# EAGLE schematic Downconverter (EAGLE 9.4.0)
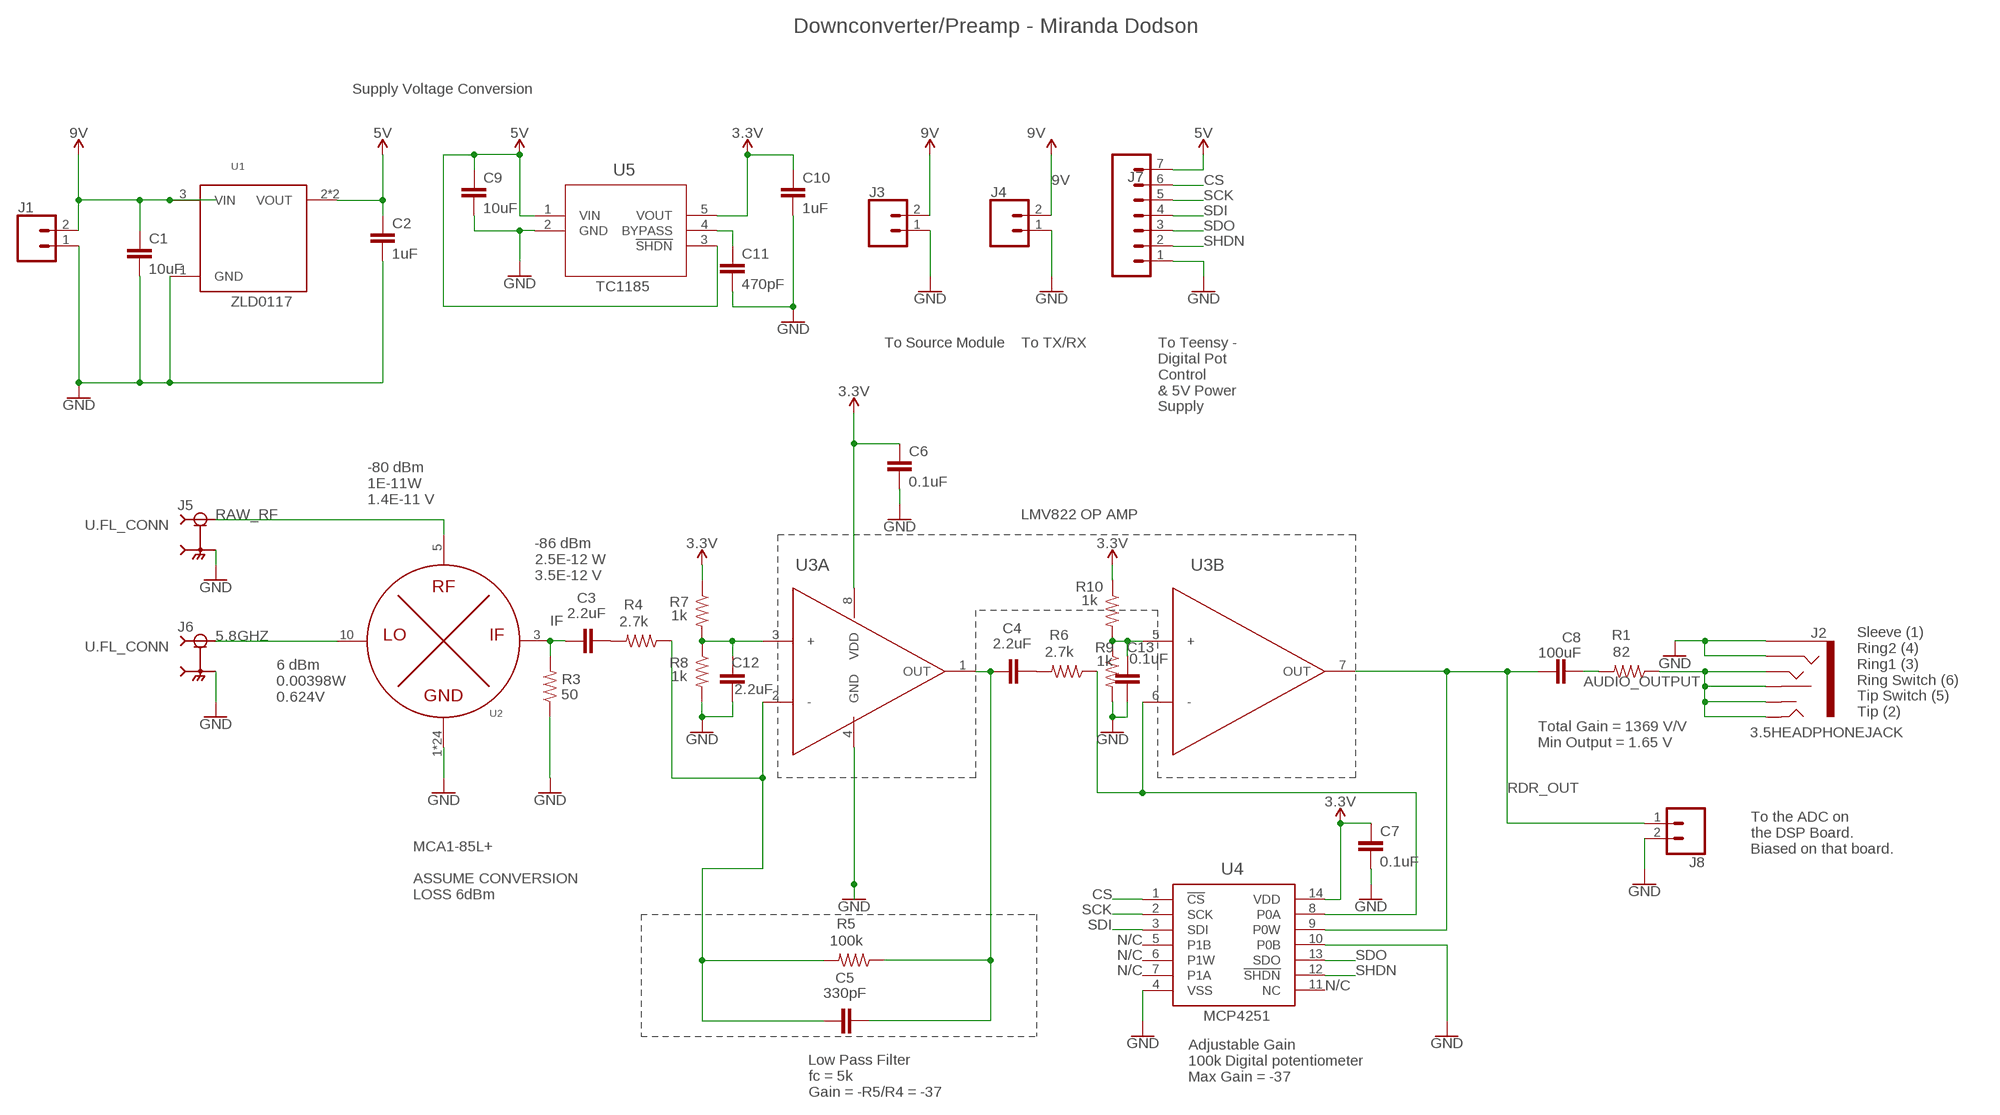
[diagram p0: schematic, sheet 1]

## Parts
C1  10uF  C0603  [R0603]
C2  1uF  C0603  [R0603]
C3  2.2uF  C0603  [R0603]
C4  2.2uF  C0603  [R0603]
C5  330pF  C0603  [R0603]
C6  0.1uF  C0603  [R0603]
C7  0.1uF  C0603  [R0603]
C8  100uF  EDK107M6R3A9GAA  [EXV-9G]
C9  10uF  C0603  [R0603]
C10  1uF  C0603  [R0603]
C11  470pF  C0603  [R0603]
C12  2.2uF  C0603  [R0603]
C13  0.1uF  C0603  [R0603]
J1  CONN_02  [1X02]
J2  3.5HEADPHONEJACK  [CONN6_SJ-43516-SMT]
J3  CONN_02  [1X02]
J4  CONN_02  [1X02]
J5  U.FL_CONN  [U.FL]
J6  U.FL_CONN  [U.FL]
J7  CONN_07  [1X07]
J8  CONN_02  [1X02]
R1  82  R0603  [R0603]
R3  50  R0603  [R0603]
R4  2.7k  R0603  [R0603]
R5  100k  R0603  [R0603]
R6  2.7k  R0603  [R0603]
R7  1k  R0603  [R0603]
R8  1k  R0603  [R0603]
R9  1k  R0603  [R0603]
R10  1k  R0603  [R0603]
U1  5V_REG  [5V_REG]
U2  MIXER  [MIXER]
U3  DUAL_OP_AMP_LMV822  [M08A]
U4  DIGITAL_POTDIGITAL_POT  [DIGITAL_POT]
U5  TC1185-3.3VCT713  [SOT-23-5_MC]

## Nets
3.3V: C6.1 C7.1 C10.1 R7.1 R10.1 U3.8(A:VDD) U4.14(VDD) U5.5(VOUT)
5.8GHZ: J6.1(SIG) U2.10(LO)
5V: C2.1 C9.1 J7.7 U1.2(VOUT) U1.4(VOUT) U5.1(VIN) U5.3(!SHDN)
9V: C1.1 J1.2 J3.2 J4.2 U1.3(VIN)
AUDIO_OUTPUT: J2.3(RINGSWITCH) J2.4(RING1) J2.7(TIPSWITCH) J2.8(TIP) R1.1
CS: J7.6 U4.1(!CS)
GND: C1.2 C2.2 C6.2 C7.2 C9.2 C10.2 C11.2 C12.2 C13.2 J1.1 J2.1(SLEEVE) J2.2(RING2) J3.1 J4.1 J5.2(GND) J5.3(GND) J6.2(GND) J6.3(GND) J7.1 J8.2 R3.1 R8.2 R9.2 U1.1(GND) U2.1(GND) U2.2(GND) U2.4(GND) U2.6(GND) U2.7(GND) U2.8(GND) U2.9(GND) U2.P$1(GND) U2.P$2(GND) U2.P$3(GND) U2.P$4(GND) U2.P$5(GND) U2.P$6(GND) U2.P$7(GND) U2.P$8(GND) U2.P$9(GND) U2.P$10(GND) U2.P$11(GND) U2.P$12(GND) U2.P$13(GND) U2.P$14(GND) U2.P$15(GND) U2.P$16(GND) U2.P$17(GND) U3.4(A:GND) U4.4(VSS) U4.10(P0B) U5.2(GND)
IF: C3.1 R3.2 U2.3(IF)
N$1: C4.1 C5.2 R5.1 U3.1(A:OUT)
N$2: C8.2 R1.2
N$3: C3.2 R4.2
N$4: C12.1 R7.2 R8.1 U3.3(A:+)
N$5: C11.1 U5.4(BYPASS)
N$7: C4.2 R6.2
N$8: C13.1 R9.1 R10.2 U3.5(B:+)
N$9: C5.1 R4.1 R5.2 U3.2(A:-)
N$13: R6.1 U3.6(B:-) U4.8(P0A)
RAW_RF: J5.1(SIG) U2.5(RF)
RDR_OUT: C8.1 J8.1 U3.7(B:OUT) U4.9(P0W)
SCK: J7.5 U4.2(SCK)
SDI: J7.4 U4.3(SDI)
SDO: J7.3 U4.13(SDO)
SHDN: J7.2 U4.12(!SHDN)
Unconnected: U4.5(P1B) U4.6(P1W) U4.7(P1A) U4.11(NC)

## Notes on the sheet
- Downconverter/Preamp - Miranda Dodson
- Supply Voltage Conversion
- TC1185
- ZLD0117
- To Source Module | To TX/RX
- To Teensy -
  Digital Pot
  Control
  & 5V Power 
  Supply
- -80 dBm
  1E-11W
  1.4E-11 V
- LMV822 OP AMP
- -86 dBm
  2.5E-12 W
  3.5E-12 V
- 6 dBm
  0.00398W
  0.624V
- Sleeve (1)
  Ring2 (4)
  Ring1 (3)
  Ring Switch (6)
  Tip Switch (5)
  Tip (2)
- Total Gain = 1369 V/V
  Min Output = 1.65 V
- To the ADC on 
  the DSP Board.
  Biased on that board.
- MCA1-85L+
  
  ASSUME CONVERSION
  LOSS 6dBm
- N/C
- N/C
- N/C
- N/C
- MCP4251
- Adjustable Gain
  100k Digital potentiometer
  Max Gain = -37
- Low Pass Filter
  fc = 5k
  Gain = -R5/R4 = -37

## Library data of the parts
C1-C7 C9-C13 = 764Library:C0603
C8 = 764Library:EDK107M6R3A9GAA; MANUFACTURER_PART_NUMBER: EDK107M6R3A9GAA; VENDOR: KEMET
J1 J3 J4 J8 = SparkFun-Connectors:CONN_02: Multi connection point. Often used as Generic Header-pin footprint for 0.1 inch spaced/style header connections On any of the 0.1 inch spaced packages, you can populate with these: Break Away Headers - Straight <https://www.sparkfun.com/products/116> (PRT-00116) Break Away Male Headers - Right Angle <https://www.sparkfun.com/products/553> (PRT-00553) Female Headers <https://www.sparkfun.com/products/115> (PRT-00115) Break Away Headers - Machine Pin <https://www.sparkfun.com/products/117> (PRT-00117) Break Away Female Headers - Swiss Machine Pin <https://www.sparkfun.com/products/743> (PRT-00743) For SCREWTERMINALS and SPRING TERMINALS visit here: Screw Terimnals on SparkFun.com <https://www.sparkfun.com/search/results?term=Screw+Terminals> (5mm/3.5mm/2.54mm spacing) This device is also useful as a general connection point to wire up your design to another part of your project. Our various solder wires solder well into these plated through hole pads. Hook-Up Wire - Assortment (Stranded, 22 AWG) <https://www.sparkfun.com/products/11375> (PRT-11375) Hook-Up Wire - Assortment (Solid Core, 22 AWG) <https://www.sparkfun.com/products/11367> (PRT-11367) View the entire wire category on our website here <https://www.sparkfun.com/categories/141> Special notes: Molex polarized connector foot print use with: PRT-08233 with associated crimp pins and housings. 2.54_SCREWTERM for use with PRT-10571. 3.5mm Screw Terminal footprints for PRT-08084 5mm Screw Terminal footprints for use with PRT-08432
J2 = 764Library:3.5HEADPHONEJACK
J5 J6 = 764Library:U.FL_CONN: U.FL Series 50 Ohm Receptacle Male Pins Ultra Small SMT Coaxial Connector; AVAILABILITY: Unavailable; DESCRIPTION: U.FL Series 50 Ohm Receptacle Male Pins Ultra Small SMT Coaxial Connector; MF: Hirose; MP: U.FL-R-SMT_10_; PACKAGE: FakePackage u; PRICE: None
J7 = SparkFun-Connectors:CONN_07: Multi connection point. Often used as Generic Header-pin footprint for 0.1 inch spaced/style header connections On any of the 0.1 inch spaced packages, you can populate with these: Break Away Headers - Straight <https://www.sparkfun.com/products/116> (PRT-00116) Break Away Male Headers - Right Angle <https://www.sparkfun.com/products/553> (PRT-00553) Female Headers <https://www.sparkfun.com/products/115> (PRT-00115) Break Away Headers - Machine Pin <https://www.sparkfun.com/products/117> (PRT-00117) Break Away Female Headers - Swiss Machine Pin <https://www.sparkfun.com/products/743> (PRT-00743) For SCREWTERMINALS and SPRING TERMINALS visit here: Screw Terimnals on SparkFun.com <https://www.sparkfun.com/search/results?term=Screw+Terminals> (5mm/3.5mm/2.54mm spacing) This device is also useful as a general connection point to wire up your design to another part of your project. Our various solder wires solder well into these plated through hole pads. Hook-Up Wire - Assortment (Stranded, 22 AWG) <https://www.sparkfun.com/products/11375> (PRT-11375) Hook-Up Wire - Assortment (Solid Core, 22 AWG) <https://www.sparkfun.com/products/11367> (PRT-11367) View the entire wire category on our website here <https://www.sparkfun.com/categories/141> Special notes: Molex polarized connector foot print use with SKU : PRT-08231 with associated crimp pins and housings. 1MM SMD Version SKU: PRT-10208 NOTES ON THE VARIANTS LOCK and LOCK_LONGPADS... This footprint was designed to help hold the alignment of a through-hole component (i.e. 6-pin header) while soldering it into place. You may notice that each hole has been shifted either up or down by 0.005 of an inch from it's more standard position (which is a perfectly straight line). This slight alteration caused the pins (the squares in the middle) to touch the edges of the holes. Because they are alternating, it causes a "brace" to hold the component in place. 0.005 has proven to be the perfect amount of "off-center" position when using our standard breakaway headers. Although looks a little odd when you look at the bare footprint, once you have a header in there, the alteration is very hard to notice. Also,if you push a header all the way into place, it is covered up entirely on the bottom side.
R1 R3-R10 = 764Library:R0603
U1 = 764Library:5V_REG
U2 = 764Library:MIXER
U3 = 764Library:DUAL_OP_AMP_LMV822
U4 = 764Library:DIGITAL_POT
U5 = 764Library:TC1185-3.3VCT713; MANUFACTURER_PART_NUMBER: TC11853.3VCT713; VENDOR: Microchip